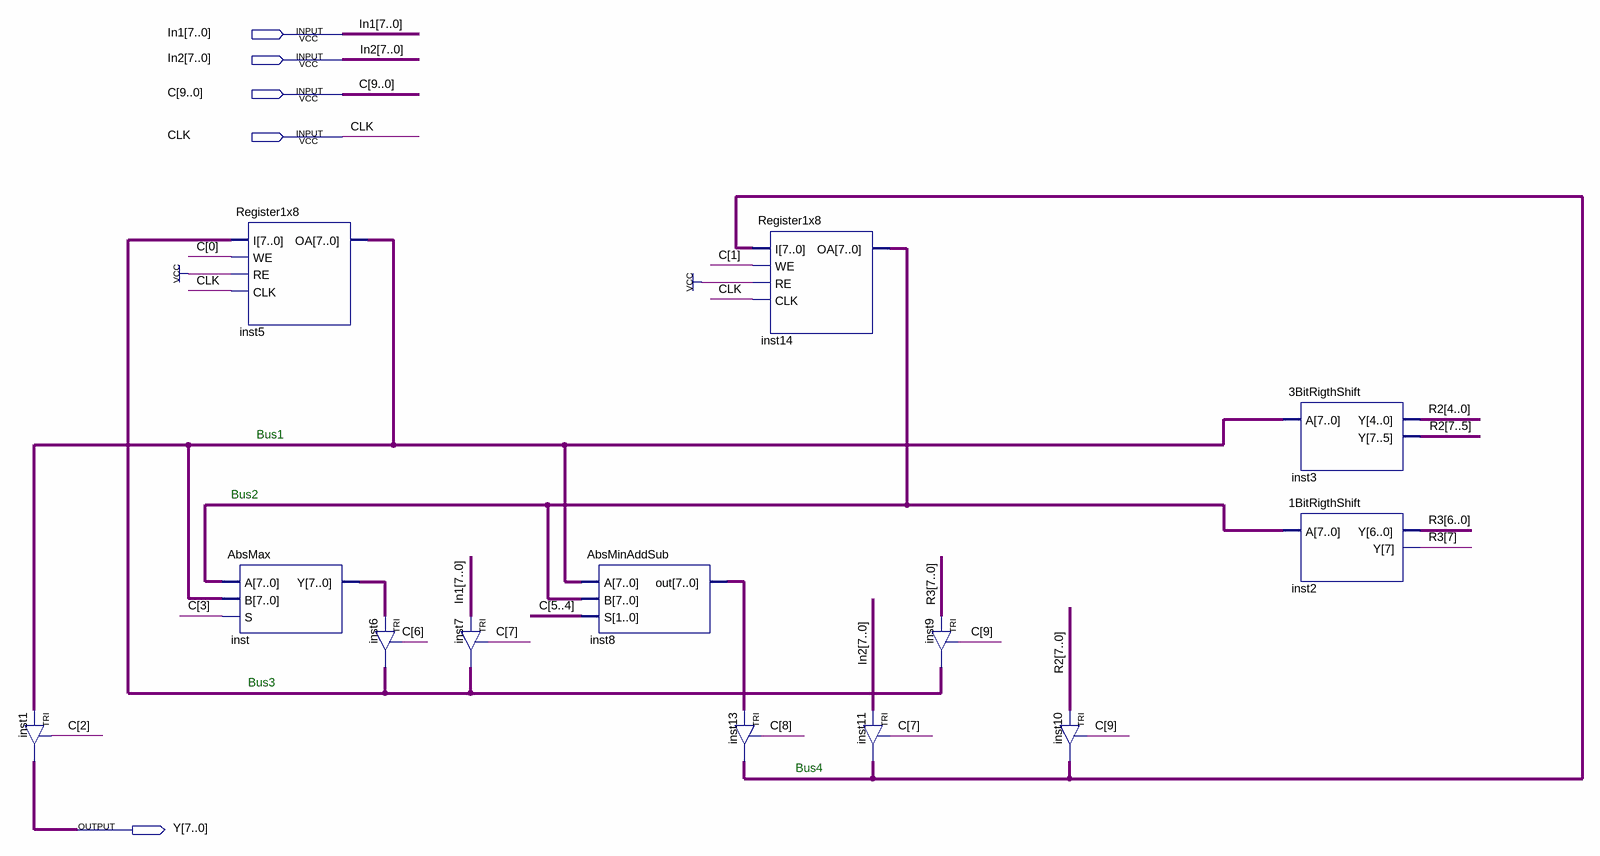
[diagram p0: schematic sheet]
// Quartus schematic Datapath.bdf as structural Verilog: 13 symbols, 5 pins
module Datapath (
  input  [7:0] In1,
  input  [7:0] In2,
  input  [9:0] C,
  input  CLK,
  output [7:0] Y
);

  wire [7:0] inst5_oa, inst6_out, inst8_out, inst13_out, inst14_oa, inst_y, R2, R3;

  TRI inst1[7:0] (.IN(inst5_oa), .OE(C[2]), .OUT(Y));
  Register1x8 inst5 (.I(inst6_out), .WE(C[0]), .RE(1'b1), .CLK(CLK), .OA(inst5_oa));
  AbsMax inst (.A(inst14_oa), .B(inst5_oa), .S(C[3]), .Y(inst_y));
  TRI inst6[7:0] (.IN(inst_y), .OE(C[6]), .OUT(inst6_out));
  TRI inst7[7:0] (.IN(In1), .OE(C[7]), .OUT(inst6_out));
  AbsMinAddSub inst8 (.A(inst5_oa), .B(inst14_oa), .S(C[5:4]), .out(inst8_out));
  Register1x8 inst14 (.I(inst13_out), .WE(C[1]), .RE(1'b1), .CLK(CLK), .OA(inst14_oa));
  TRI inst13[7:0] (.IN(inst8_out), .OE(C[8]), .OUT(inst13_out));
  TRI inst11[7:0] (.IN(In2), .OE(C[7]), .OUT(inst13_out));
  TRI inst9[7:0] (.IN(R3), .OE(C[9]), .OUT(inst6_out));
  TRI inst10[7:0] (.IN(R2), .OE(C[9]), .OUT(inst13_out));
  \3BitRigthShift  inst3 (.A(inst5_oa), .Y(R2));
  \1BitRigthShift  inst2 (.A(inst14_oa), .Y(R3));

  // Notes on the sheet:
  //   Bus1
  //   Bus2
  //   Bus3
  //   Bus4
endmodule
